# Altium schematic sheet Fuse-Board.SchDoc
size A4; SheetNumber: 1; SheetTotal: 1
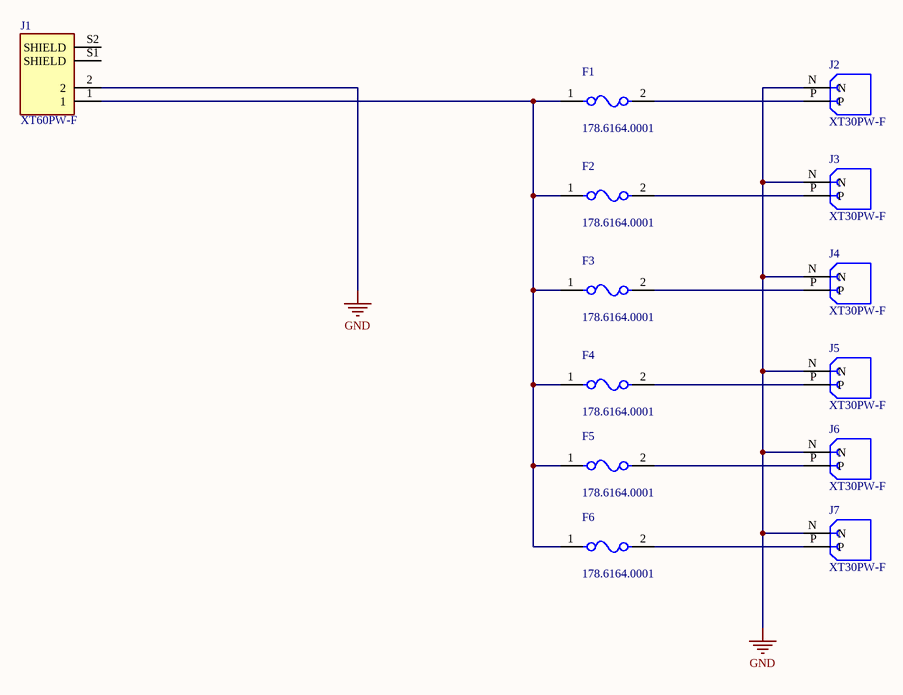
[diagram p0: Fuse-Board.SchDoc]

## Parts
F1  178.6164.0001  [FP-178_6164_0001-MFG]
F2  178.6164.0001  [FP-178_6164_0001-MFG]
F3  178.6164.0001  [FP-178_6164_0001-MFG]
F4  178.6164.0001  [FP-178_6164_0001-MFG]
F5  178.6164.0001  [FP-178_6164_0001-MFG]
F6  178.6164.0001  [FP-178_6164_0001-MFG]
J1  XT60PW-F  [AMASS_XT60PW-F]
J2  XT30PW-F  [AMASS_XT30PW-F]
J3  XT30PW-F  [AMASS_XT30PW-F]
J4  XT30PW-F  [AMASS_XT30PW-F]
J5  XT30PW-F  [AMASS_XT30PW-F]
J6  XT30PW-F  [AMASS_XT30PW-F]
J7  XT30PW-F  [AMASS_XT30PW-F]

## Nets
GND: J1.2 J2.N J3.N J4.N J5.N J6.N J7.N
NetF1_1: F1.1 F2.1 F3.1 F4.1 F5.1 F6.1 J1.1
NetF1_2: F1.2 J2.P
NetF2_2: F2.2 J3.P
NetF3_2: F3.2 J4.P
NetF4_2: F4.2 J5.P
NetF5_2: F5.2 J6.P
NetF6_2: F6.2 J7.P

Not connected (* = marked no-connect by the designer): J1 S1(SHIELD) S2(SHIELD)

## Library data of the parts
F1-F6 = CMP-08604-000013-1: FUSE HOLDER BLADE 80V PCB; Manufacturer: Littelfuse Inc; Number Of Fuses: 1; Description: Fuse Holder  80V 1 Circuit Blade Through Hole; Conn Orientation: Vertical; Package: 0; Device Class L1: Circuit Protection; Category: Fuse; Digikey Description: FUSE HOLDER BLADE 80V PCB; RoHS: TRUE; ComponentLink2Description: Datasheet; ComponentLink2URL: https://www.littelfuse.com/~/media/commercial-vehicle/datasheets/automotive-fuse-holders/ato/littelfuse-fuse-holder-ato-flr-pcb-datasheet.pdf; Temperature Range High: +130°C; Lead Free: Yes; Voltage Rating Ac: 80V; Mouser Description: Fuse Holder HOLDER FOR FLR (ATO) PCB 1-PIN; Manufacturer Part Number: 178.6164.0001; Height: 17.5mm; Device Class L3: unset; Octopart: https://octopart.com/178.6164.0001-littelfuse-44502275; Automotive: No; Voltage Rating Dc: 80V; Device Class L2: Fuse Holders; Temperature: to +130°C
J1 = XT60PW-F: Socket DC Supply Connector Female; MF: AMASS; SnapEDA_Link: https://www.snapeda.com/parts/XT60PW-F/AMASS/view-part/?ref=snap; Package: Package; Availability: Not in stock; Price: None; Check_prices: https://www.snapeda.com/parts/XT60PW-F/AMASS/view-part/?ref=eda; MP: XT60PW-F; Value: *
J2-J7 = XT30PW-F: Socket; DC supply; XT30; female; PIN: 2; on PCBs; THT; yellow; 15A; MF: amass; Package: None; Price: None; Value: *; SnapEDA_Link: https://www.snapeda.com/parts/XT30PW-F/AMASS/view-part/?ref=snap; MP: XT30PW-F; Availability: Not in stock; Check_prices: https://www.snapeda.com/parts/XT30PW-F/AMASS/view-part/?ref=eda